# Altium schematic sheet FDC.SchDoc
size A3; SheetNumber: 5; SheetTotal: 15
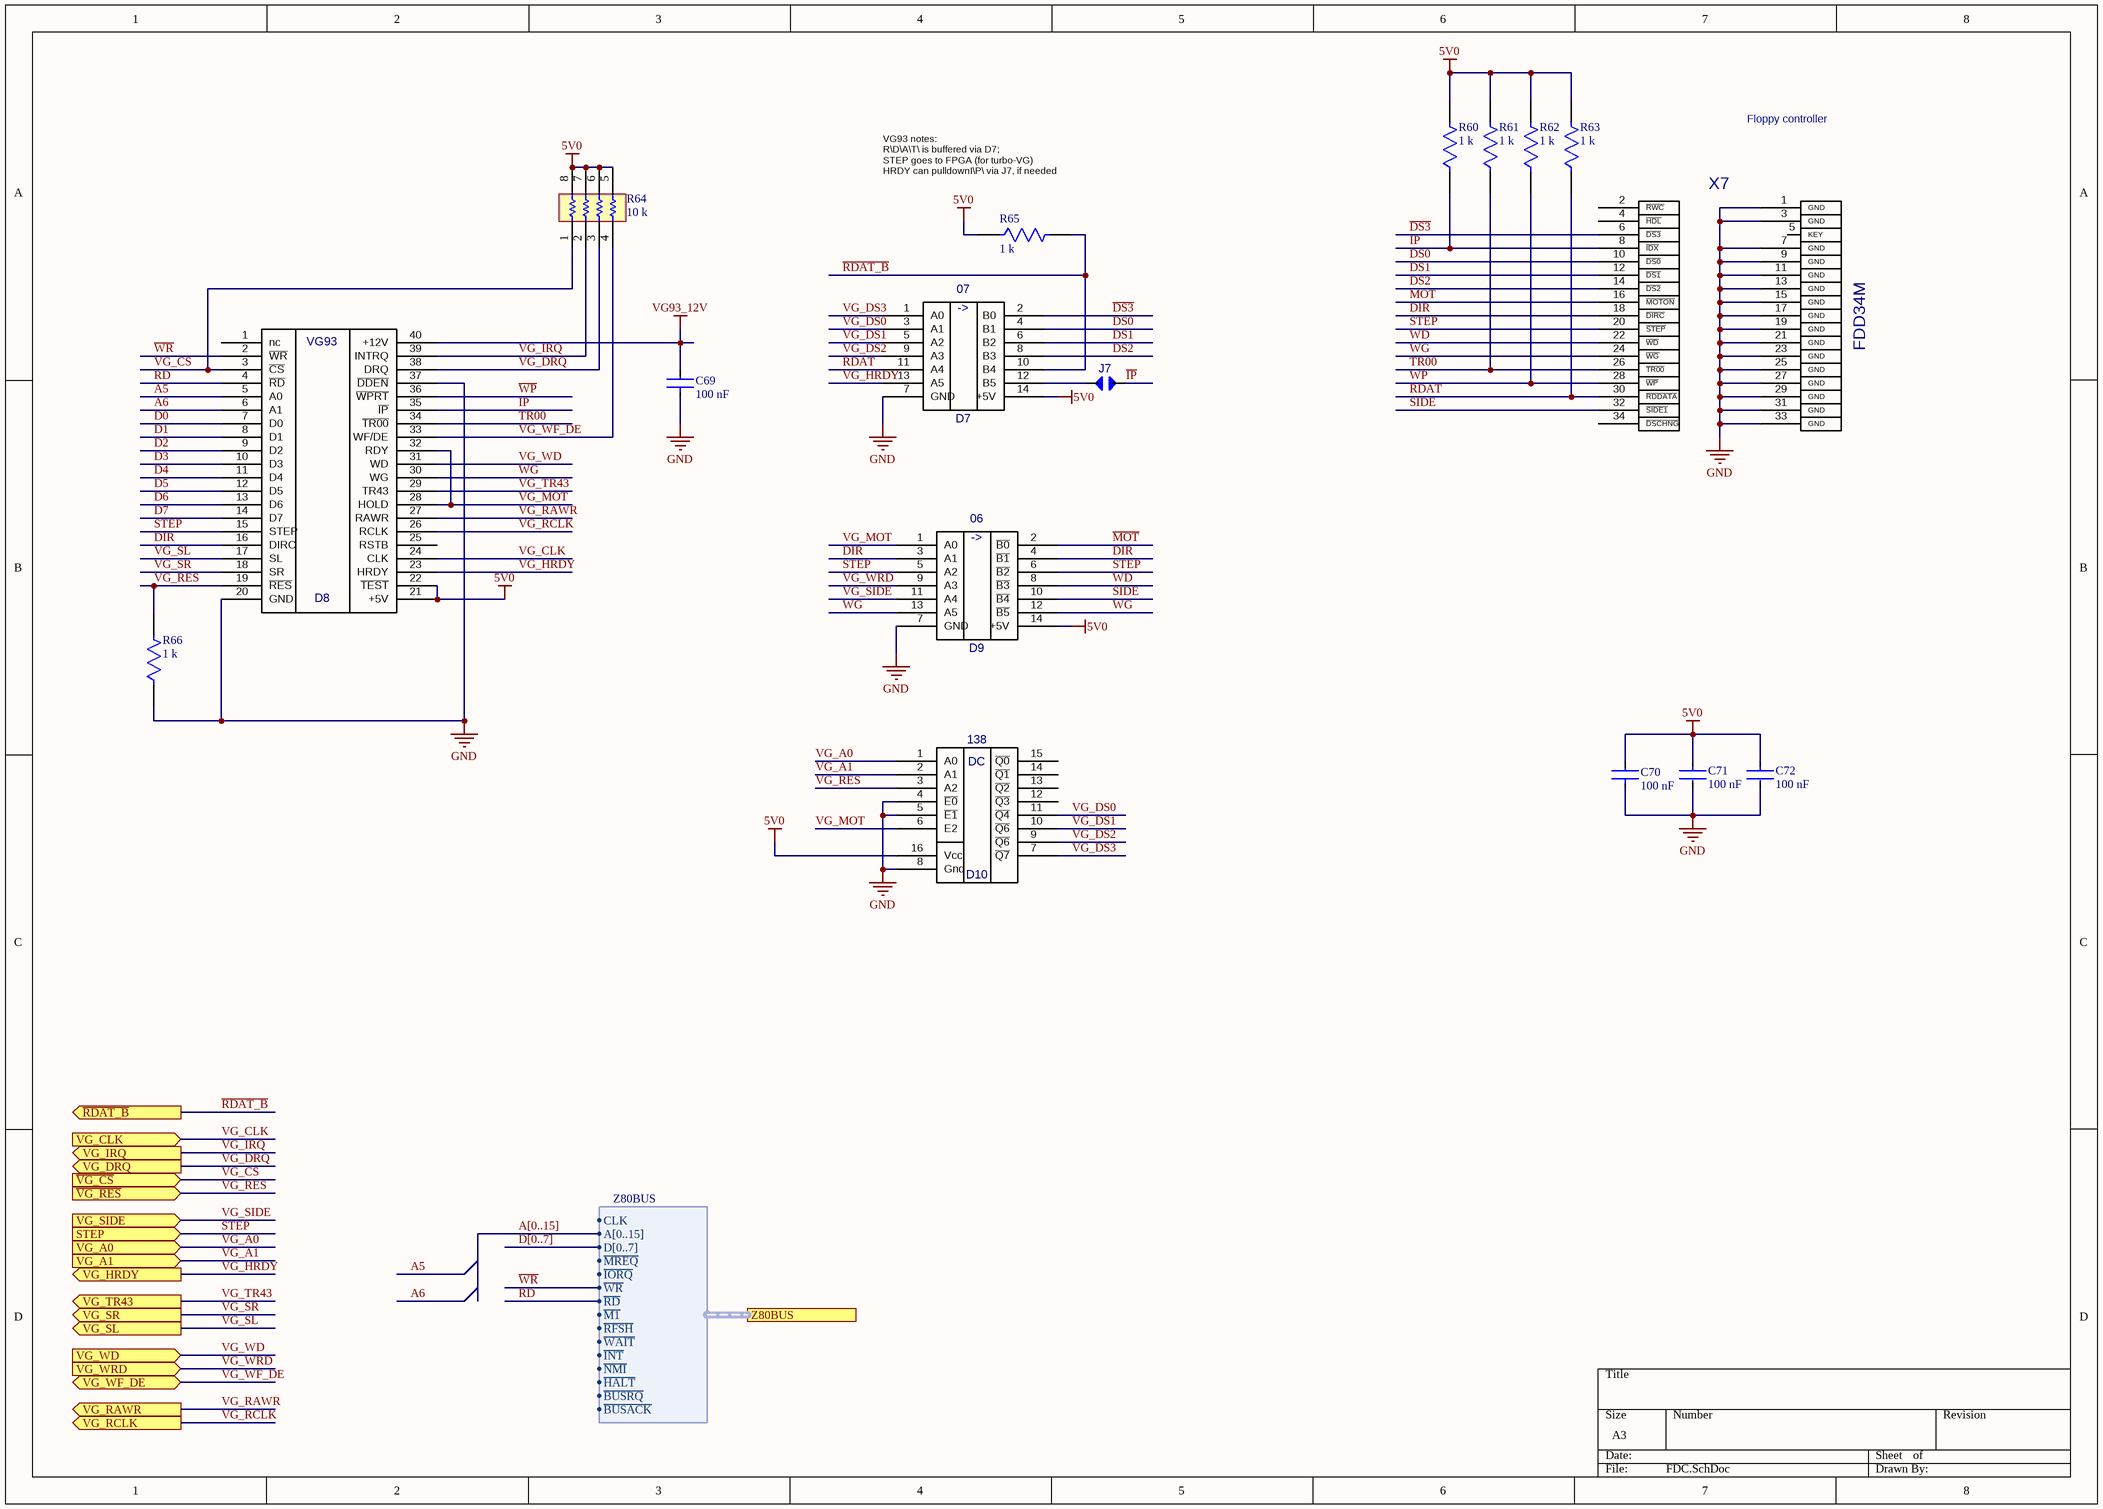
[diagram p0: FDC.SchDoc]

## Parts
C69  Capacitance: 100 nF  [CC0805]  (hidden comment: CC0805-1.5pF)
C70  Capacitance: 100 nF  [CC0805]  (hidden comment: CC0805-1.5pF)
C71  Capacitance: 100 nF  [CC0805]  (hidden comment: CC0805-1.5pF)
C72  Capacitance: 100 nF  [CC0805]  (hidden comment: CC0805-1.5pF)
D7  07  [SO14]
D8  KR1818VG93  [DIP40]  (value not drawn)
D9  06  [SO14]
D10  138  [SO16]
J7  JUMPER  [JUMPER_JUMPER(Primary)]  (value not drawn)
R60  Resistance: 1 k  [CR0805]  (hidden comment: CR0805-51)
R61  Resistance: 1 k  [CR0805]  (hidden comment: CR0805-51)
R62  Resistance: 1 k  [CR0805]  (hidden comment: CR0805-51)
R63  Resistance: 1 k  [CR0805]  (hidden comment: CR0805-51)
R64  Resistance: 10 k  [BOUR-CAY16-J4_V]  (hidden comment: CAY16-103J4LF)
R65  Resistance: 1 k  [CR0805]  (hidden comment: CR0805-51)
R66  Resistance: 1 k  [CR0805]  (hidden comment: CR0805-51)
X7  FDD34M  [FDD34M]

## Ports
STEP (in), VG_A0 (in), VG_A1 (in), VG_CLK (in), VG_DRQ (out), VG_HRDY (out), VG_IRQ (out), VG_RAWR (out), VG_RCLK (out), VG_SIDE (in), VG_SL (out), VG_SR (out), VG_TR43 (out), VG_WD (in), VG_WF_DE (bidir), VG_WRD (in), Z80BUS (harness Z80BUS), ~{RDAT_B} (out), ~{VG_CS} (in), ~{VG_RES} (in)

## Harnesses
Z80BUS: A[0..15], D[0..7], ~{MREQ}, ~{IORQ}, ~{WR}, ~{RD}, ~{M1}, ~{RFSH}, ~{WAIT}, ~{INT}, ~{NMI}, ~{HALT}, ~{BUSRQ}, ~{BUSACK}, CLK

## Nets
5V0: C70.2 C71.1 C72.1 D7.14(+5V) D8.21(+5V) D8.22(~{TEST}) D9.14(+5V) D10.16(Vcc) R60.2 R61.2 R62.2 R63.2 R64.5 R64.6 R64.7 R64.8 R65.1
GND: C69.1 C70.1 C71.2 C72.2 D7.7(GND) D8.20(GND) D8.37(~{DDEN}) D9.7(GND) D10.4(~{E0}) D10.5(~{E1}) D10.8(Gnd) R66.1 X7.1(GND) X7.3(GND) X7.7(GND) X7.9(GND) X7.11(GND) X7.13(GND) X7.15(GND) X7.17(GND) X7.19(GND) X7.21(GND) X7.23(GND) X7.25(GND) X7.27(GND) X7.29(GND) X7.31(GND) X7.33(GND)
VG93_12V: C69.2 D8.40(+12V)
A5: D8.5(A0)
A6: D8.6(A1)
D0: D8.7(D0)
D1: D8.8(D1)
D2: D8.9(D2)
D3: D8.10(D3)
D4: D8.11(D4)
D5: D8.12(D5)
D6: D8.13(D6)
D7: D8.14(D7)
~{DIR}: D9.4(~{B1}) X7.18(~{DIRC})
~{DS0}: D7.4(B1) X7.10(~{DS0})
~{DS1}: D7.6(B2) X7.12(~{DS1})
~{DS2}: D7.8(B3) X7.14(~{DS2})
~{DS3}: D7.2(B0) X7.6(~{DS3})
DIR: D8.16(DIRC) D9.3(A1)
~{IP}: D8.35(~{IP}) J7.1 R60.1 X7.8(~{IDX})
~{MOT}: D9.2(~{B0}) X7.16(~{MOTON})
~{RD}: D8.4(~{RD}) ; port Z80BUS.~{RD}
~{RDAT}: D7.11(A4) R63.1 X7.30(~{RDDATA})
~{RDAT_B}: D7.10(B4) R65.2 ; port ~{RDAT_B}
~{SIDE}: D9.10(~{B4}) X7.32(~{SIDE1})
~{STEP}: D9.6(~{B2}) X7.20(~{STEP})
STEP: D8.15(STEP) D9.5(A2) ; port STEP
~{TR00}: D8.34(~{TR00}) R61.1 X7.26(~{TR00})
~{VG_CS}: D8.3(~{CS}) R64.1 ; port ~{VG_CS}
~{VG_RES}: D8.19(~{RES}) D10.3(A2) R66.2 ; port ~{VG_RES}
VG_A0: D10.1(A0) ; port VG_A0
VG_A1: D10.2(A1) ; port VG_A1
VG_CLK: D8.24(CLK) ; port VG_CLK
VG_DRQ: D8.38(DRQ) R64.3 ; port VG_DRQ
VG_DS0: D7.3(A1) D10.11(~{Q4})
VG_DS1: D7.5(A2) D10.10(~{Q6})
VG_DS2: D7.9(A3) D10.9(~{Q6})
VG_DS3: D7.1(A0) D10.7(~{Q7})
VG_HRDY: D7.13(A5) D8.23(HRDY) ; port VG_HRDY
VG_IRQ: D8.39(INTRQ) R64.2 ; port VG_IRQ
VG_MOT: D8.28(HOLD) D8.32(RDY) D9.1(A0) D10.6(E2)
VG_RAWR: D8.27(RAWR) ; port VG_RAWR
VG_RCLK: D8.26(RCLK) ; port VG_RCLK
VG_SIDE: D9.11(A4) ; port VG_SIDE
VG_SL: D8.17(SL) ; port VG_SL
VG_SR: D8.18(SR) ; port VG_SR
VG_TR43: D8.29(TR43) ; port VG_TR43
VG_WD: D8.31(WD) ; port VG_WD
VG_WF_DE: D8.33(WF/DE) R64.4 ; port VG_WF_DE
VG_WRD: D9.9(A3) ; port VG_WRD
~{WD}: D9.8(~{B3}) X7.22(~{WD})
~{WG}: D9.12(~{B5}) X7.24(~{WG})
~{WP}: D8.36(~{WPRT}) R62.1 X7.28(~{WP})
~{WR}: D8.2(~{WR}) ; port Z80BUS.~{WR}
WG: D8.30(WG) D9.13(A5)
NetD7_12: D7.12(B5) J7.0

Not connected (* = marked no-connect by the designer): D8 1(nc) 25(RSTB); D10 12(~{Q3}) 13(~{Q2}) 14(~{Q1}) 15(~{Q0}); X7 2(~{RWC}) 4(~{HDL}) 5(KEY) 34(~{DSCHNG})

## Buses and harness runs
bus A[0..15]
bus D[0..7]

## Notes on the sheet
- Floppy controller
- (near R65) VG93 notes:
  R\D\A\T\ is buffered via D7;
  STEP goes to FPGA (for turbo-VG)
  HRDY can pulldownI\P\ via J7, if needed
- (in symbol 06) ->
- (in symbol 07) ->
- (in symbol 138) DC
- (in symbol KR1818VG93) VG93

## Library data of the parts
C69-C72 = CC0805: CL21 Series 0805 1.5pF 50V ±0.25pF Tolerance C0G Multilayer Ceramic Chip Capacitor; Manufacturer Part Number: CL21C1R5CBANNNC; Manufacturer: Samsung; value: 1.5pF; Category: Cap; Case/Package: 0805
D7 = 07: Value: 74HCT07; Case/Package: SOIC-14; Category: IC
D9 = 06: Value: 74HCT06; Case/Package: SOIC-14; Category: IC
D10 = 138: value: 74HCT138; Case/Package: SOIC-16; Category: IC
J7 = JUMPER: HLT->~IP; Value: PLS-2; Case/Package: PLS-2; Category: Connector
R60-R63 R65 R66 = CR0805: 51Ω ±0.5% 0.1W 1/10W Chip Resistor 0805 (2012 Metric) Thin Film; Manufacturer: Susumu; Manufacturer Part Number: RR1220Q-510-D; Case/Package: 0805; Number of Pins: 2; Termination: SMD/SMT; value: 51Ω; Category: Res; Number of Terminations: 2
R64 = CMP-1747-00005-1: Chip Resistor Array, 10 KOhm, +/- 5%, 62.5 mW, -55 to 125 degC, 8-Pin SMD, RoHS, Tape and Reel; Power Rating: 100 mW; Case\Package: 0603; Voltage Rating: 75 V; Tolerance: 1%; Packaging: Tape and Reel; Min Operating Temperature: -55 degC; Pins: 2; Radiation Hardening: No; DatasheetVersion: Jan-15; Length: 0.063 inch; RoHSCompliant: true; Mount: Surface Mount; ComponentLink1Description: Manufacturer URL; ComponentLink1URL: http://www.bourns.com/; Weight: 7.1E-05 oz; ComponentLink2URL: http://www.bourns.com/docs/Product-Datasheets/CATCAY.pdf; PackageReference: CAY16-J4; Width: 0.031 inch; Case Code (Imperial): 0603; Case Code (Metric): 1608; REACH SVHC: Yes; Max Operating Temperature: 155 degC; ComponentLink2Description: Datasheet; Height: 0.022 inch; PackageDescription: 8-Pin Surface Mount Device, Body 1.6 x 3.2 mm, Pitch 0.8 mm
X7 = FDD34M: Value: Shrouded Header 34 pos 2.54mm 2 row; Case/Package: IDC-34; Category: Connector
D8 = KR1818VG93: Value: KR1818VG93; Case/Package: DIP-40; Category: IC